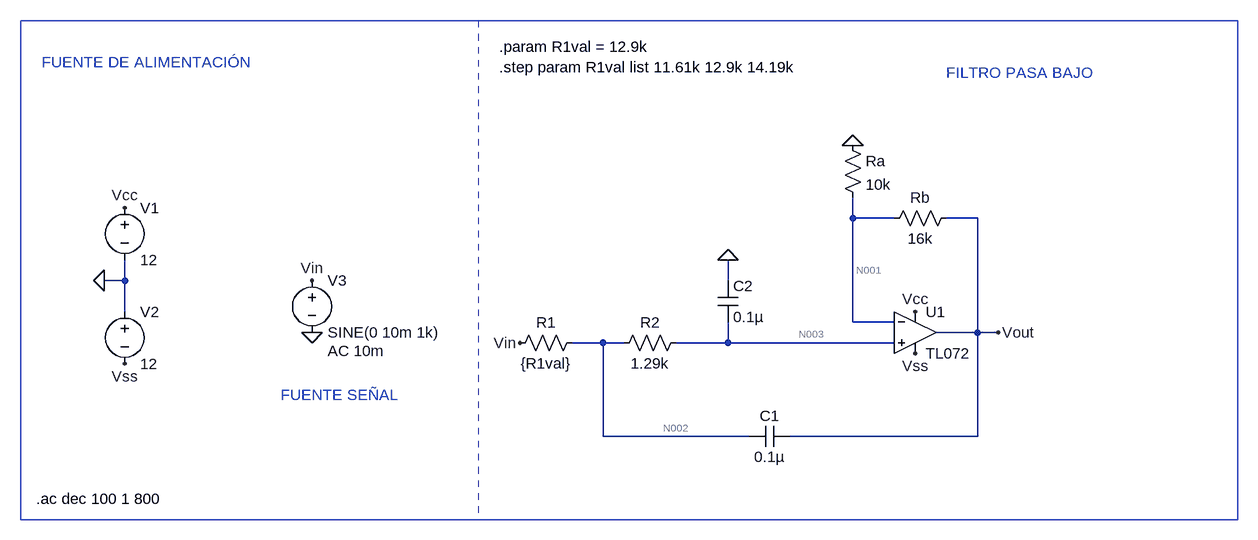
[diagram p0: schematic filtro_pb.asc]
* filtro_pb.asc
* U1: TL072 (symbol ZZZ\OpAmp\TL072 not available, pins judged from their places): In+=N003 In-=N001 V+=Vcc V-=Vss OUT=Vout
Rb Vout N001 16k
Ra 0 N001 10k
R2 N003 N002 1.29k
R1 N002 Vin {R1val}
C2 0 N003 0.1µ
C1 Vout N002 0.1µ
V1 Vcc 0 12
V2 0 Vss 12
V3 Vin 0 SINE(0 10m 1k) AC 10m
* FUENTE DE ALIMENTACIÓN
* FUENTE SEÑAL
* FILTRO PASA BAJO
.ac dec 100 1 800
.param R1val = 12.9k
.step param R1val list 11.61k 12.9k 14.19k
.backanno
.end

* Results of the author's LTspice run, read from the files saved beside the schematic
* Operating Point (first step), zero values left out:
*   r1val = 11.61 k
*   V(vout) = 27.79 µV
*   V(vss) = -12 V
*   V(vcc) = 12 V
*   V(n001) = 10.43 µV
*   V(n003) = -542.5 nV
*   V(n002) = -488.2 nV
*   I(R1) = -42.05 pA
*   I(R2) = -42.05 pA
*   I(Ra) = -1.043 nA
*   I(Rb) = 1.085 nA
*   I(V3) = -42.05 pA
*   I(V2) = -11.39 mA
*   I(V1) = -11.39 mA
*   Ix(u1:1) = 42.05 pA
*   Ix(u1:2) = 42.05 pA
*   Ix(u1:3) = 11.39 mA
*   Ix(u1:4) = -11.39 mA
*   Ix(u1:5) = -1.085 nA
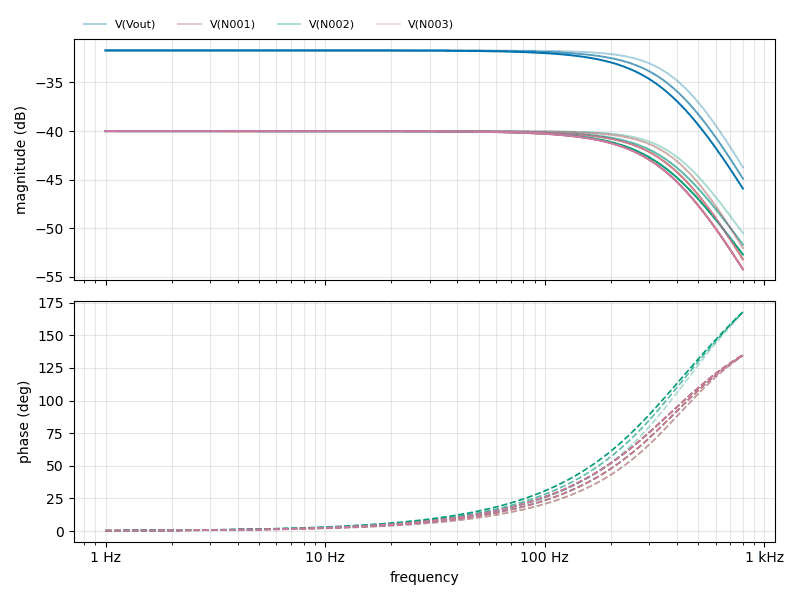
[diagram p1: AC Analysis of filtro_pb.asc, plotted from the saved traces]
* AC Analysis, 3 runs:
*   V(Vout) [r1val=11610]: -31.70 dB at 1 Hz, -43.73 dB at 800 Hz, peak -31.70 dB at 1 Hz, 3 dB below the peak at 396.1 Hz
*   V(Vout) [r1val=12900]: -31.70 dB at 1 Hz, -44.89 dB at 800 Hz, peak -31.70 dB at 1 Hz, 3 dB below the peak at 344.9 Hz
*   V(Vout) [r1val=14190]: -31.70 dB at 1 Hz, -45.92 dB at 800 Hz, peak -31.70 dB at 1 Hz, 3 dB below the peak at 302.7 Hz
*   V(N001) [r1val=11610]: -40.00 dB at 1 Hz, -52.03 dB at 800 Hz, peak -40.00 dB at 1 Hz, 3 dB below the peak at 396.1 Hz
*   V(N001) [r1val=12900]: -40.00 dB at 1 Hz, -53.19 dB at 800 Hz, peak -40.00 dB at 1 Hz, 3 dB below the peak at 344.9 Hz
*   V(N001) [r1val=14190]: -40.00 dB at 1 Hz, -54.22 dB at 800 Hz, peak -40.00 dB at 1 Hz, 3 dB below the peak at 302.7 Hz
*   V(N002) [r1val=11610]: -40.00 dB at 1 Hz, -50.50 dB at 800 Hz, peak -40.00 dB at 1 Hz, 3 dB below the peak at 418.7 Hz
*   V(N002) [r1val=12900]: -40.00 dB at 1 Hz, -51.67 dB at 800 Hz, peak -40.00 dB at 1 Hz, 3 dB below the peak at 362.2 Hz
*   V(N002) [r1val=14190]: -40.00 dB at 1 Hz, -52.69 dB at 800 Hz, peak -40.00 dB at 1 Hz, 3 dB below the peak at 315.8 Hz
*   V(N003) [r1val=11610]: -40.00 dB at 1 Hz, -52.03 dB at 800 Hz, peak -40.00 dB at 1 Hz, 3 dB below the peak at 396.1 Hz
*   V(N003) [r1val=12900]: -40.00 dB at 1 Hz, -53.19 dB at 800 Hz, peak -40.00 dB at 1 Hz, 3 dB below the peak at 344.9 Hz
*   V(N003) [r1val=14190]: -40.00 dB at 1 Hz, -54.22 dB at 800 Hz, peak -40.00 dB at 1 Hz, 3 dB below the peak at 302.7 Hz